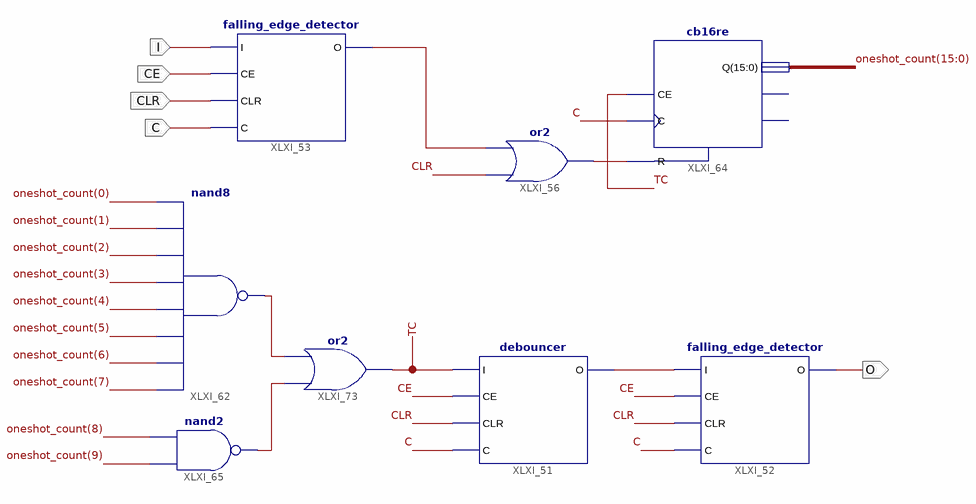
[diagram p0: schematic sheet 1]
// Xilinx ISE schematic keypress_filter.sch (spartan6) as structural Verilog: 8 symbols, 5 ports
module keypress_filter (
  input  C,
  input  CLR,
  input  I,
  input  CE,
  output O
);

  wire TC, XLXN_83, XLXN_88, XLXN_158, XLXN_159, XLXN_171;
  wire [15:0] oneshot_count;

  or XLXI_56 (XLXN_83, CLR, XLXN_88);
  falling_edge_detector XLXI_53 (.C(C), .CE(CE), .CLR(CLR), .I(I), .O(XLXN_88));
  falling_edge_detector XLXI_52 (.C(C), .CE(CE), .CLR(CLR), .I(XLXN_171), .O(O));
  debouncer XLXI_51 (.C(C), .CE(CE), .CLR(CLR), .I(TC), .O(XLXN_171));
  cb16re XLXI_64 (.C(C), .CE(TC), .R(XLXN_83), .Q(oneshot_count));  // open: CEO, TC
  nand XLXI_62 (XLXN_158, oneshot_count[7], oneshot_count[6], oneshot_count[5], oneshot_count[4], oneshot_count[3], oneshot_count[2], oneshot_count[1], oneshot_count[0]);
  nand XLXI_65 (XLXN_159, oneshot_count[9], oneshot_count[8]);
  or XLXI_73 (TC, XLXN_159, XLXN_158);
endmodule
